# Altium schematic sheet SPI Bus Transceiver.SchDoc
size A; SheetNumber: 12; SheetTotal: 15
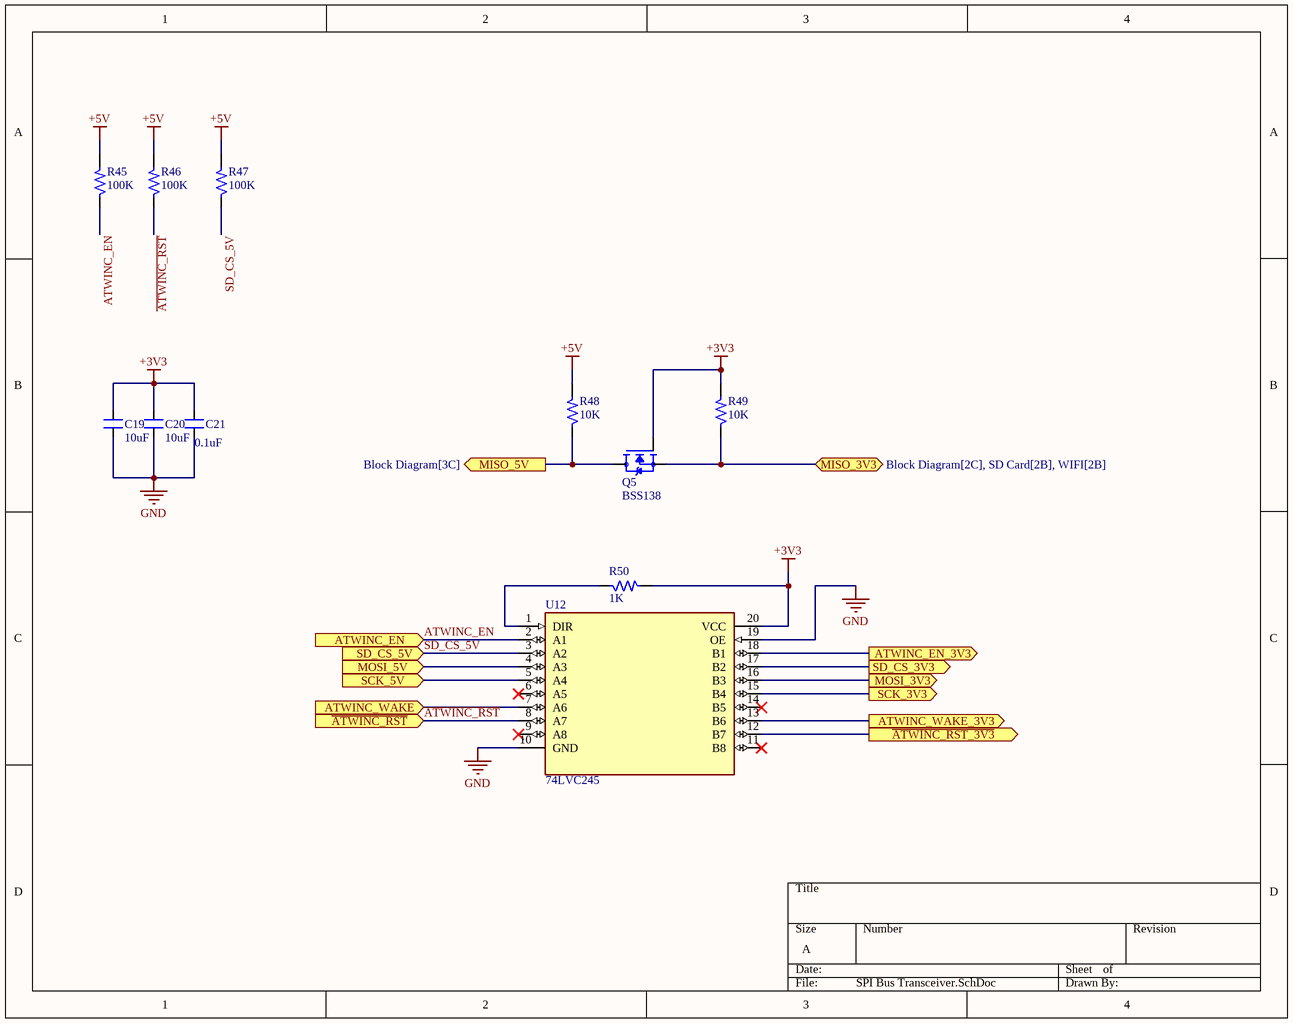
[diagram p0: SPI Bus Transceiver.SchDoc]

## Parts
C19  10uF  [CAP_1206]
C20  10uF  [CAP_1206]
C21  0.1uF  [CAP_0805]
Q5  BSS138  [SOT95P240X111-3N]
R45  100K  [RES_0805]
R46  100K  [RES_0805]
R47  100K  [RES_0805]
R48  10K  [RES_0805]
R49  10K  [RES_0805]
R50  1K  [RES_0805]
U12  74LVC245  [SOIC-20-W]

## Ports
ATWINC_EN (in, see Block Diagram[3C], ATMEGA2560-16AU[1A]), ATWINC_EN_3V3 (out, see Block Diagram[2C], WIFI[2C]), ATWINC_WAKE (in, see Block Diagram[3C], ATMEGA2560-16AU[1A]), ATWINC_WAKE_3V3 (out, see Block Diagram[2C], WIFI[2C]), MISO_3V3 (bidir, see Block Diagram[2C], SD Card[2B], WIFI[2B]), MISO_5V (out, see Block Diagram[3C]), MOSI_3V3 (out, see Block Diagram[2C], SD Card[3B], WIFI[2B]), MOSI_5V (in, see Block Diagram[3C]), SCK_3V3 (out, see Block Diagram[2C], SD Card[2B], WIFI[2B]), SCK_5V (in, see Block Diagram[3C]), SD_CS_3V3 (out, see Block Diagram[2C], SD Card[2B]), SD_CS_5V (in, see Block Diagram[3C], ATMEGA2560-16AU[1B]), ~{ATWINC_RST_3V3} (out, see Block Diagram[2C], WIFI[4B]), ~{ATWINC_RST} (in, see Block Diagram[3C], ATMEGA2560-16AU[1A])

## Nets
+3V3: C19.2 C20.2 C21.2 Q5.1(G) R49.2 R50.2 U12.20(VCC)
+5V: R45.2 R46.2 R47.2 R48.2
GND: C19.1 C20.1 C21.1 U12.10(GND) U12.19(OE)
~{ATWINC_RST}: R46.1 U12.8(A7) ; port ~{ATWINC_RST}
~{ATWINC_RST_3V3}: U12.12(B7) ; port ~{ATWINC_RST_3V3}
ATWINC_EN: R45.1 U12.2(A1) ; port ATWINC_EN
ATWINC_EN_3V3: U12.18(B1) ; port ATWINC_EN_3V3
ATWINC_WAKE: U12.7(A6) ; port ATWINC_WAKE
ATWINC_WAKE_3V3: U12.13(B6) ; port ATWINC_WAKE_3V3
MISO_3V3: Q5.2(S) R49.1 ; port MISO_3V3
MISO_5V: Q5.3(D) R48.1 ; port MISO_5V
MOSI_3V3: U12.16(B3) ; port MOSI_3V3
MOSI_5V: U12.4(A3) ; port MOSI_5V
SCK_3V3: U12.15(B4) ; port SCK_3V3
SCK_5V: U12.5(A4) ; port SCK_5V
SD_CS_3V3: U12.17(B2) ; port SD_CS_3V3
SD_CS_5V: R47.1 U12.3(A2) ; port SD_CS_5V
NetR50_1: R50.1 U12.1(DIR)

Not connected (* = marked no-connect by the designer): U12 6(A5)* 9(A8)* 11(B8)* 14(B5)*

## Library data of the parts
C19 C20 = CAP_10uF-50V-10%-1206: 10µF ±10% 50V Ceramic Capacitor X7R 1206 (3216 Metric); Manufacturer: KEMET; Manufacturer Part Number: CL31B106KBHNNNE; Alternate Part Number-1: GRT31CR61H106ME01L; Case/Package: 1206; Supplier-1: SIRICOM; Supplier Part Number-1: CC1206KKX5R9BB106
C21 = CAP_0.1uF-50V-5%-0805: 0.1µF ±5% 50V Ceramic Capacitor X7R 0805 (2012 Metric); Manufacturer: AVX Corporation; Manufacturer Part Number: 08055C104JAT4A; Alternate Part Number-1: 0805B104M500; Case/Package: 0805; Supplier-1: SIRICOM; Supplier Part Number-1: 0805B104J500CT
Q5 = BSS138: N-Channel 50V 220mA (Ta) 360mW (Ta) Surface Mount SOT-23-3; Price: None; MP: BSS138; Value: *; Availability: Unavailable; Package: None
R45-R47 = RES_100K-0.125W-1%-0805: 100 kOhms ±1% 0.125W, 1/8W Chip Resistor 0805 (2012 Metric) Automotive AEC-Q200 Thick Film; Manufacturer: Walsin; Manufacturer Part Number: WR08X1003FTL; Alternate Part Number-1: NA; Case/Package: 0805; Supplier-1: SIRICOM; Supplier Part Number-1: WR08X1003FTL
R48 R49 = RES_10K-0.125W-1%-0805: 10 kOhms ±1% 0.125W, 1/8W Chip Resistor 0805 (2012 Metric) Automotive AEC-Q200 Thick Film; Manufacturer: CTS; Manufacturer Part Number: WR08X1002FTL; Case/Package: 0805; Supplier-1: SIRICOM; Supplier Part Number-1: WR08X1002FTL; Alternate Part Number-1: WR08X1002FTL
R50 = RES_1K-0.125W-1%-0805: 1 kOhms ±1% 0.125W, 1/8W Chip Resistor 0805 (2012 Metric) Moisture Resistant Thick Film; Manufacturer: Walsin; Manufacturer Part Number: WR08X1001FTL; Case/Package: 0805; Supplier-1: SP ROAD; Supplier Part Number-1: RC0805JR-071KL; Alternate Part Number-1: WR08X1001FTL
U12 = 74LVC245: Transceiver, Non-Inverting 1 Element 8 Bit per Element 3-State Output 20-TSSOP; MF: ON Semiconductor; Package: TSSOP-20 ON Semiconductor; Check_prices: https://www.snapeda.com/parts/74LVC245/Onsemi/view-part/?ref=eda; Value: *; Price: None; MP: 74LVC245; Availability: In Stock; SnapEDA_Link: https://www.snapeda.com/parts/74LVC245/Onsemi/view-part/?ref=snap